# Altium schematic sheet SX1308_GTW_e381v02c_Top.SchDoc
size B; DocumentNumber: 5; SheetNumber: 5; SheetTotal: 5
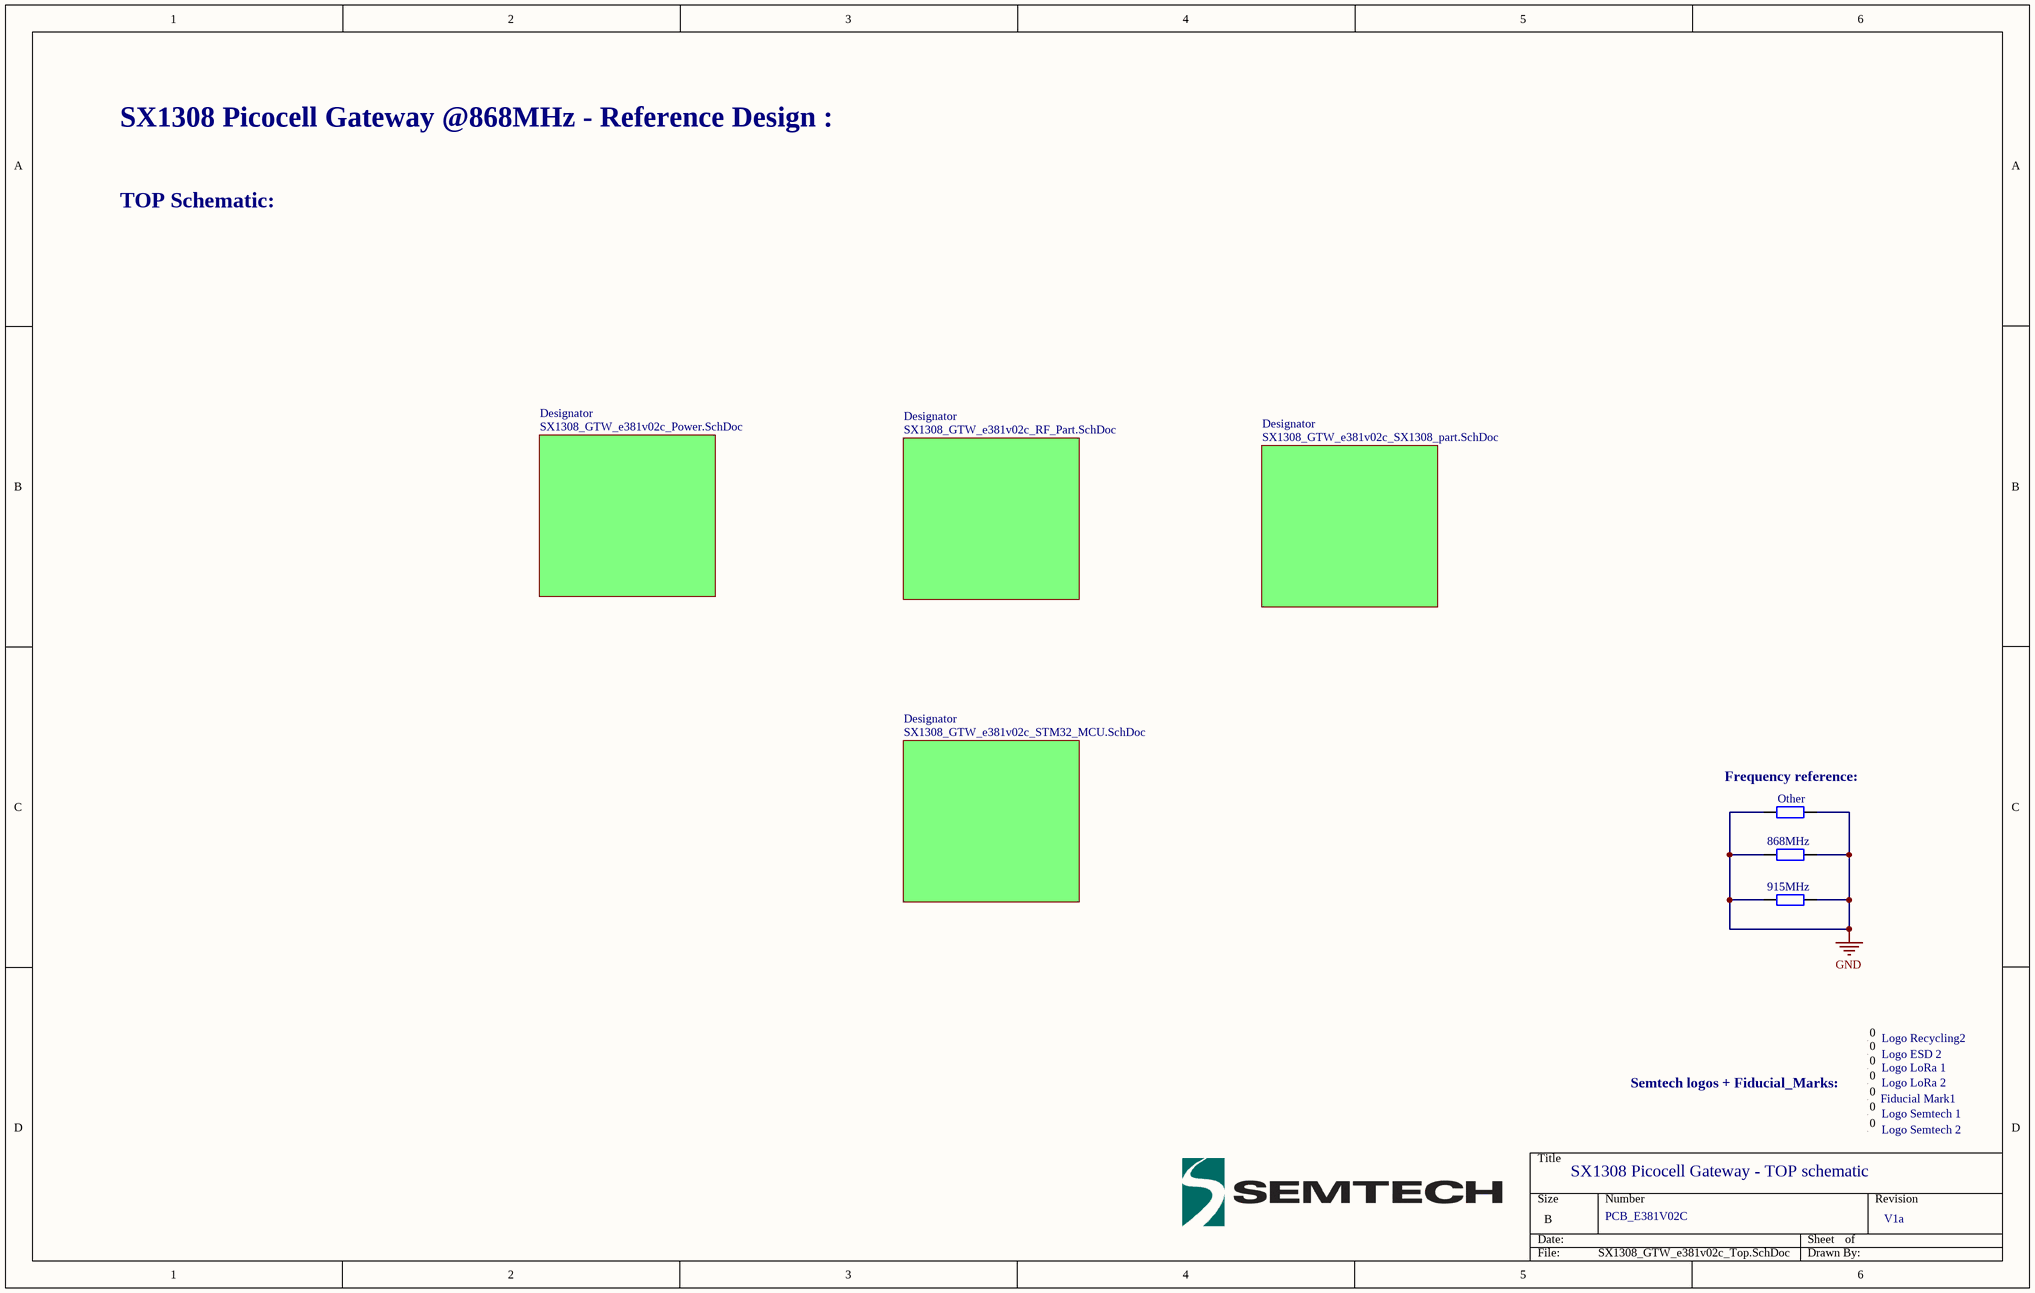
[diagram p0: SX1308_GTW_e381v02c_Top.SchDoc]

## Parts
868MHz  Resistor  [rlc_402_smd]  (value not drawn)
915MHz  Resistor  [rlc_402_smd]  (value not drawn)
Fiducial_Mark1  Logo symbol  BOT  [fiducial_mark_signal_top]  (value not drawn)
Logo_ESD_2  Logo symbol  [Logo ESD]  (value not drawn)
Logo_LoRa_1  Logo symbol TOP  [Logo LoRa Size3]  (value not drawn)
Logo_LoRa_2  Logo symbol TOP  [Logo LoRa Size3]  (value not drawn)
Logo_Recycling2  Logo symbol  [Logo Recycling1]  (value not drawn)
Logo_Semtech_1  Logo symbol TOP  [logo_semtech_horiz_size3]  (value not drawn)
Logo_Semtech_2  Logo Semtech  Bot2  [logo_semtech_horiz_size2]  (value not drawn)
Other  Resistor  [rlc_402_smd]  (value not drawn)

## Sub-sheets
Designator = SX1308_GTW_e381v02c_Power.SchDoc: no entries
Designator = SX1308_GTW_e381v02c_SX1308_part.SchDoc: no entries
Designator = SX1308_GTW_e381v02c_RF_Part.SchDoc: no entries
Designator = SX1308_GTW_e381v02c_STM32_MCU.SchDoc: no entries

## Nets
GND: 868MHz.1 868MHz.2 915MHz.1 915MHz.2 Other.1 Other.2

Not connected (* = marked no-connect by the designer): Fiducial_Mark1 0; Logo_ESD_2 0; Logo_LoRa_1 0; Logo_LoRa_2 0; Logo_Recycling2 0; Logo_Semtech_1 0; Logo_Semtech_2 0

## Notes on the sheet
- SX1308 Picocell Gateway @868MHz - Reference Design :
- TOP Schematic:
- (near Other) Frequency reference:
- Semtech logos + Fiducial_Marks:
- SX1308 Picocell Gateway - TOP schematic
- PCB_E381V02C
- V1a

## Library data of the parts
868MHz 915MHz Other = Resistor: Resistor SMD - IEC symbol version; LatestRevisionDate: 27-Jul-20  -  Semtech; Value: ?
Fiducial_Mark1 Logo_ESD_2 Logo_LoRa_1 Logo_LoRa_2 Logo_Recycling2 Logo_Semtech_1 Logo_Semtech_2 = Logo: Schematic symbol for Logo